# EAGLE design lm3410-boost-flashlight-driver-20mm-mk-1.3.1 (EAGLE 7.5.0)
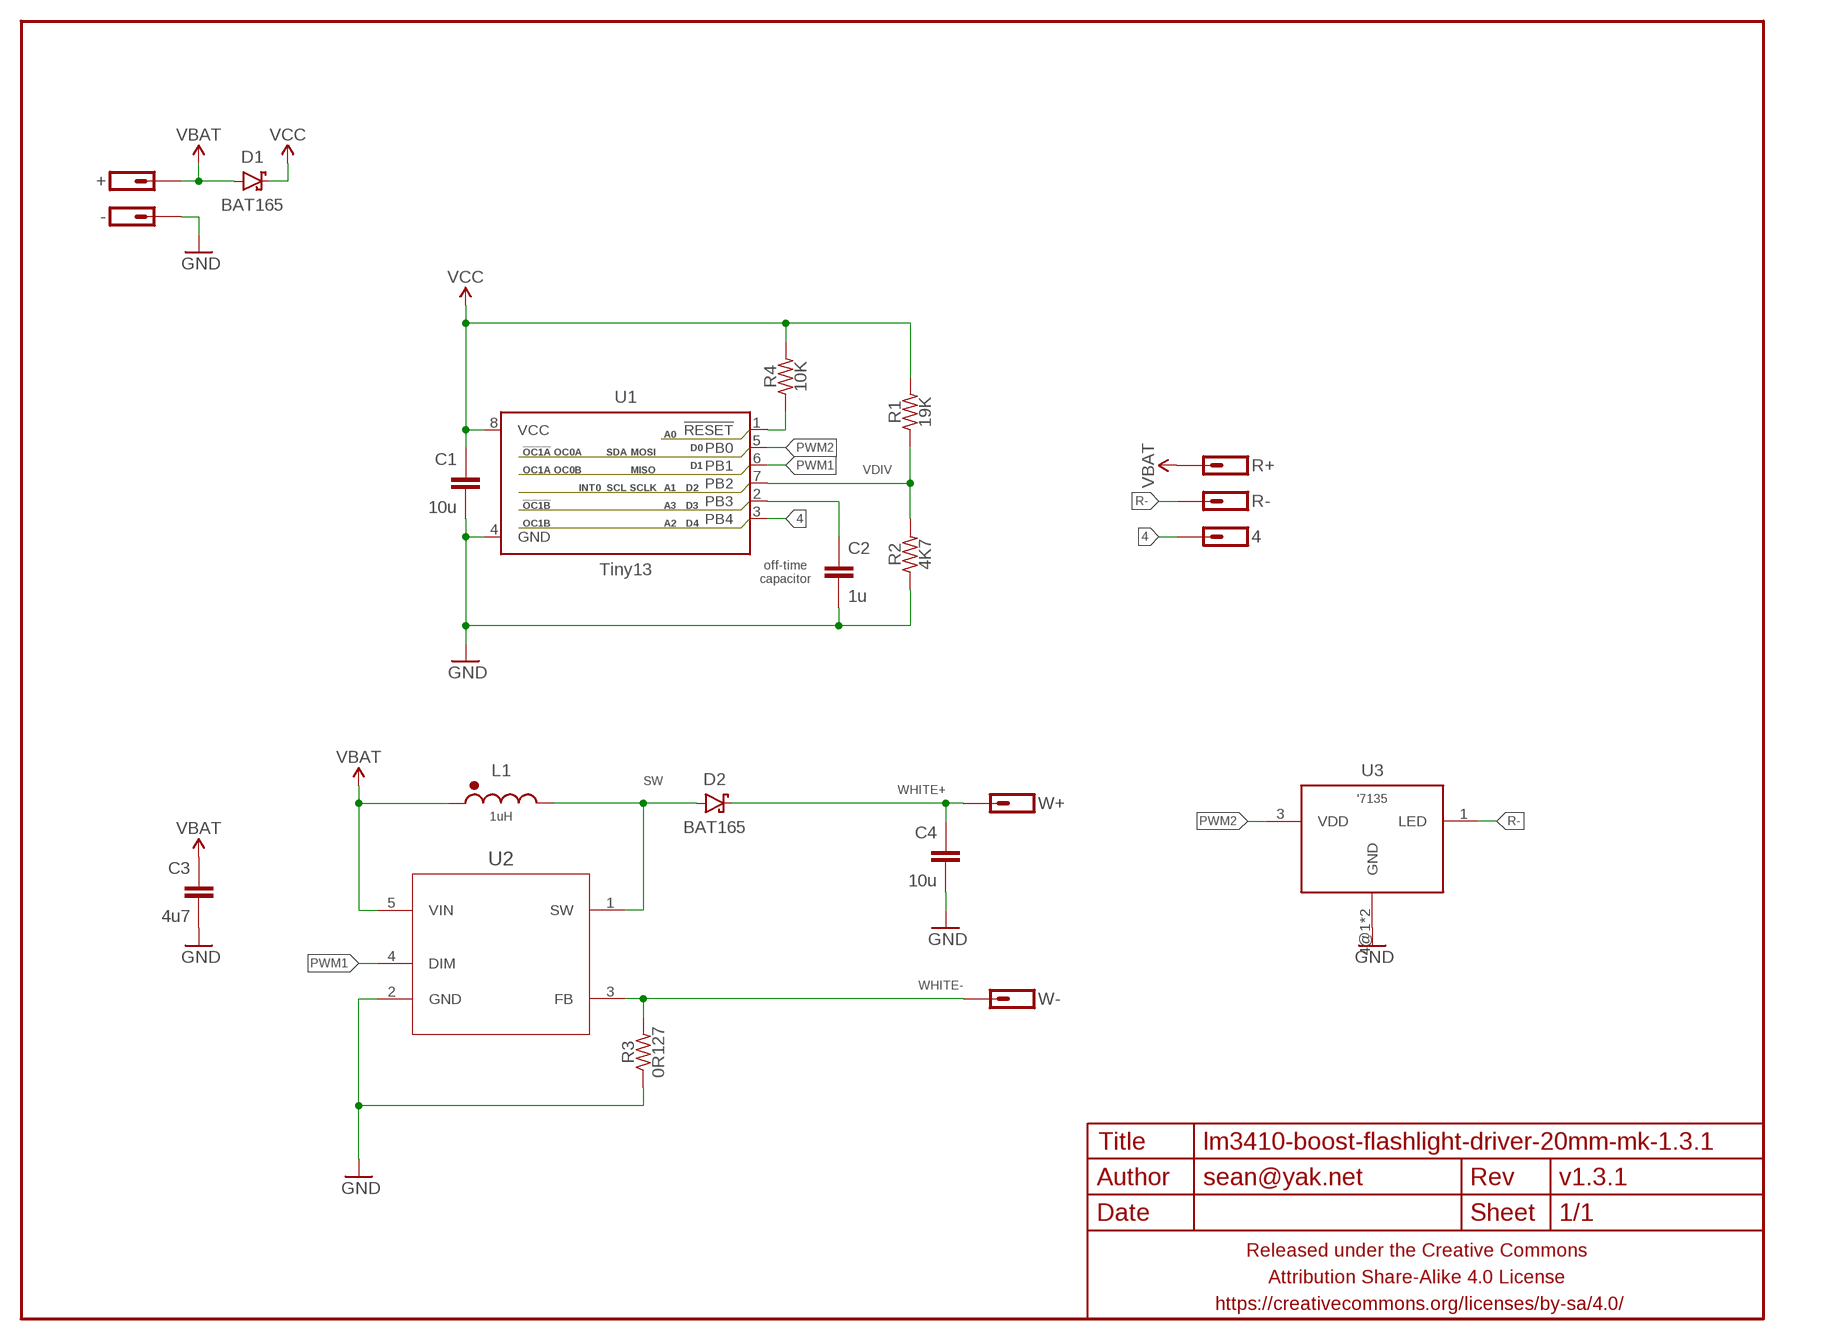
[diagram p0: schematic, sheet 1]

## Parts
4  M01SMD-1MM-DIA-NS  [1X01-SMD-1MM-DIA-NS]
+  M01PTH-1MM-CIR-NS  [1X01-1MM-CIR-NS]
-  M01NOT-A-VIA-NOPE  [1X01_NOSILK_NOSTOP]
C1  10u  CAPACITOR-CERAMICC0603-TIGHTER  [C0603-TIGHTER]
C2  1u  CAPACITOR-CERAMICC0603-TIGHTER  [C0603-TIGHTER]
C3  4u7  CAPACITOR-CERAMICC0603-TIGHTER  [C0603-TIGHTER]
C4  10u  CAPACITOR-CERAMICC0603-TIGHTER  [C0603-TIGHTER]
D1  BAT165  DIODE-SCHOTTKYSOD323  [SOD323-SCHOTTKY]
D2  BAT165  DIODE-SCHOTTKYSOD123  [SOD123-SCHOTTKY]
FRAME1  FRAME-LETTERNO_PACKAGE  [DUMMY]
L1  1uH  INDUCTORPFL2512  [PFL2512]
R1  19K  RESISTORR0603-TIGHTER  [R0603-TIGHTER]
R2  4K7  RESISTORR0603-TIGHTER  [R0603-TIGHTER]
R3  0R127  RESISTORR0805  [R0805]
R4  10K  RESISTORR0402  [R0402]
R+  M01SMD-1MM-DIA-NS  [1X01-SMD-1MM-DIA-NS]
R-  M01SMD-1MM-DIA-NS  [1X01-SMD-1MM-DIA-NS]
U1  Tiny13  ATTINY13SOIC-NARROWPADS  [SO08-NARROWER]
U2  LM3410XMF  [SOT95P285X120-5N]
U3  '7135  AMC7135SOT-89-NOTHERM  [SOT89-NOTHERM]
W+  M01PTH-1.2MM-NS  [1X01-1.2MM-NS]
W-  M01PTH-1.2MM-NS  [1X01-1.2MM-NS]

## Nets
4: 4.P$1 U1.3(PB4)
GND: -.P$1 C1.2 C2.2 C3.2 C4.2 R2.1 R3.1 U1.4(GND) U2.2(GND) U3.4@1(GND) U3.4@2(GND)
N$1: R4.1 U1.1(!RESET)
N$2: C2.1 U1.2(PB3)
PWM1: U1.6(PB1) U2.4(DIM)
PWM2: U1.5(PB0) U3.3(VDD)
R-: R-.P$1 U3.1(LED)
SW: D2.A L1.P$2 U2.1(SW)
VBAT: +.1 C3.1 D1.A L1.P$1 R+.P$1 U2.5(VIN)
VCC: C1.1 D1.C R1.2 R4.2 U1.8(VCC)
VDIV: R1.1 R2.2 U1.7(PB2)
WHITE+: C4.1 D2.C W+.P$1
WHITE-: R3.2 U2.3(FB) W-.P$1

## Notes on the sheet
- off-time
  capacitor

## Library data of the parts
4 + - R+ R- W+ W- = a_parts:M01: Header 1 Standard 1-pin 0.1" header. Use with straight break away headers (SKU : PRT-00116), right angle break away headers (PRT-00553), swiss pins (PRT-00743), machine pins (PRT-00117), and female headers (PRT-00115).
C1-C4 = a_parts:CAPACITOR-CERAMIC: CAPACITOR, European symbol
D1 D2 = a_parts:DIODE-SCHOTTKY: Schottky diodes in SFE's production catalog BAT20J 1A 23V 0.62Vf RB751 120mA 40V 0.37Vf PMEG4005EJ 0.5A 40V 0.42Vf MBRA140 1A 40V 0.5Vf B340A 3A 40V SMA
FRAME1 = a_parts:FRAME-LETTER: Schematic Frame Standard 8.5x11 US Letter frame; DESIGNER: sean@yak.net; VERSION: v1.3.1
L1 = a_parts:INDUCTOR: Inductors Basic Inductor/Choke - 0603 and 1206. Footprints are not proven and vary greatly between part numbers. SRN6045- 33uH, 20% 1.4A SDR0403-560KL - 56uH, 10%, 500mA RMS/740mA peak
R1-R4 = a_parts:RESISTOR: RESISTOR, American symbol
U1 = a_parts:ATTINY13: Atmel 8-pin 1kB flash uC
U2 = a_parts:LM3410XMF: Constant Current Boost and SEPIC LED Driver; MPN: LM3410XMF; OC_FARNELL: 1685357; OC_NEWARK: 75M6032; PACKAGE: SOT-5; SUPPLIER: National Semiconductor
U3 = a_parts:AMC7135

## Board
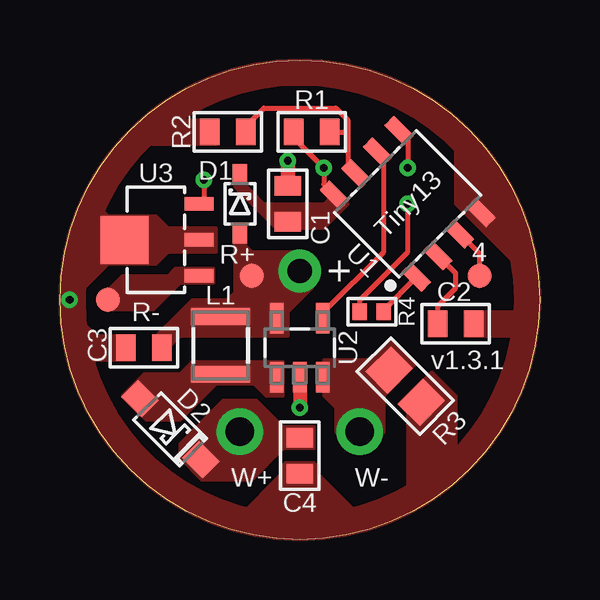
[diagram p1: board, top side]
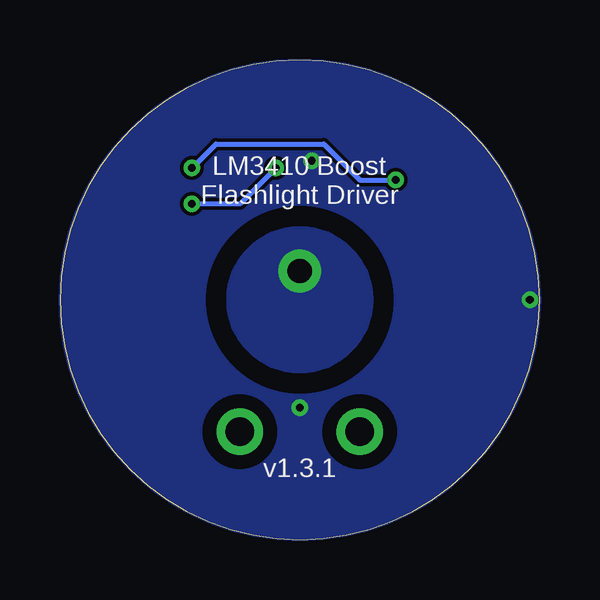
[diagram p2: board, bottom side, seen from below]

Size 20 x 20 mm. Coordinates in mm from the lower left corner, seen from the top.
Outline: 0,10 arc-180 20,10 arc-180 0,10
Copper layers (1*16): Top 0.0356mm / dielectric 1.5011mm / Bottom 0.0356mm
Design rules "LaenPCBOrder2 *": minimum track width 6mil, minimum drill 13mil, track to track 6mil, track to pad 6mil, pad to pad 6mil, via to via 6mil, smd to smd 6mil, copper to edge 0mil, drill to drill 6mil, minimum pad ring 7mil, minimum via ring 7mil, stop-mask expansion 3mil, vias tented up to drill 20mil, thermal gap 10mil
bRestrict: area 6.2,3.2 to 8.8,5.8; area 11.2,3.2 to 13.8,5.8; area 6.5,6.5 to 13.5,13.5

### Footprints (pad centres in the part's own frame; a part is rotated, then mirrored left to right if it is on the bottom)
1X01-SMD-1MM-DIA-NS = smd 1 x 1: P$1 0,0
1X01-1MM-CIR-NS = drill 1.016 pad 1.778: 1 0,0
1X01_NOSILK_NOSTOP = drill 0.33: P$1 0,0
C0603-TIGHTER = smd 0.8 x 1.1: 1 -0.75,0; 2 0.75,0
SOD323-SCHOTTKY = smd 0.8 x 0.6: A -1.25,0; C 1.25,0
SOD123-SCHOTTKY = smd 1.2 x 1: A -1.8,0; C 1.8,0
PFL2512 = smd 0.7 x 2.45: P$1 -1.2,0; P$2 1.2,0
R0603-TIGHTER = smd 0.8 x 1.1: 1 -0.75,0; 2 0.75,0
R0805 = smd 1.3 x 1.5: 1 -0.95,0; 2 0.95,0
R0402 = smd 0.6 x 0.7: 1 -0.5,0; 2 0.5,0
SO08-NARROWER = smd 0.6 x 1.2: 1 -1.905,-2.416; 2 -0.635,-2.416; 3 0.635,-2.416; 4 1.905,-2.416; 5 1.905,2.416; 6 0.635,2.416; 7 -0.635,2.416; 8 -1.905,2.416
SOT95P285X120-5N = smd 1.27 x 0.559: 1 -1.219,0.965; 2 -1.219,0; 3 -1.219,-0.965; 4 1.219,-0.965; 5 1.219,0.965
SOT89-NOTHERM = smd 0.58 x 1.2: 1 -1.5,-1.8; 3 1.5,-1.8; 4@1 0,-1.8 | smd 2 x 2: 4@2 0,1.3
1X01-1.2MM-NS = drill 1.2 pad 1.93: P$1 0,0

### Placement (x,y rotation side)
4  17.5,11 0 top
+  10,11.2 180 top
-  0.4,10 90 bottom
C1  9.5,14 90 top
C2  16.5,9 0 top
C3  3.5,8 180 top
C4  10,3.5 270 top
D1  7.5,14 90 top
D2  4.6,4.6 315 top
FRAME1  0,0 0 top
L1  6.7,8.1 270 top
R1  10.5,17 180 top
R2  7,17 0 top
R3  14.4,6.4 135 top
R4  13,9.5 180 top
R+  8,11 0 top
R-  2,10 180 top
U1  14.5,14 45 top
U2  10,8 90 top
U3  4,12.5 90 top
W+  7.5,4.5 270 top
W-  12.5,4.5 180 top

### Tracks (layer width: path | path; a pad name or v marks a point on that pad's centre or on a via)
4
  Top 0.2: 4.P$1 17.5,11.9 U1.3
GND  (via drill 0.33)
  Top 0.575: U2.2 v10,5.5
  Top 0.6: v9.5,15.8 C1.2
  pour Top (isolate 0.152, rank 6, no thermals): 0,10 arc90 10,0 arc90 20,10 19,10 arc-90 10,1 arc-90 1,10
  pour Bottom (isolate 0.152, rank 6, no thermals): 10,0 arc-90 0,10 arc-90 10,20 arc-90 20,10 arc-90
  pour Top (isolate 0.152, rank 6, no thermals): 20,10 arc90 10,20 arc90 0,10 1,10 arc-90 10,19 arc-90 19,10
  pour Top (isolate 0.152, rank 5, no thermals): 7.5,1 9.2,2.7 9.2,3 9.4,3.2 10.6,3.2 10.8,3 10.8,2.7 12.5,1
  pour Top (isolate 0.152, rank 5, no thermals): 14.5,5.5 14.5,2 15,2 16.5,3.5 16.5,6 15.5,7 14.5,6
  pour Top (isolate 0.152, rank 5, no thermals): 17,9.5 17,8.5 19,8.5 19,9.5
  pour Top (isolate 0.152, rank 5, no thermals): 16.5,14 19,11.5 19,13.5 17.5,15 17.5,15.5 16.5,16.5
  pour Top (isolate 0.152, rank 5, no thermals): 3.5,16.5 6.5,16.5 6.5,17.5 4,17.5 3.5,17
  pour Top (isolate 0.152, rank 5, no thermals): 2,11.5 4,11.5 4.5,12 6.5,12 6.5,13 4.5,13 4,13.5 2,13.5 1.5,14 1,13.5 1,12 0.5,11.5 0.5,10.5 1,10.5
  pour Top (isolate 0.152, rank 5, no thermals): 1,9 1.5,8.5 3.1,8.5 3.1,7.5 1.5,7.5 1,7
N$1
  Top 0.2: R4.1 13.5,9.58 U1.1
N$2
  Top 0.2: C2.1 15.75,9.75 16.5,10.5 16.5,11.1 U1.2
PWM1
  Top 0.2: U2.4 10.96,9.46 13.5,12 13.5,15.9 U1.6
PWM2  (via drill 0.33)
  Top 0.2: v6,15 6,14.2 U3.3 | U1.5 14.5,16.69 v14.5,15.5
  Bottom 0.2: v14.5,15.5 13.5,16.5 9,16.5 7.5,15 v6,15
R-
  pour Top (isolate 0.152, rank 5, no thermals): 2,10.4 2.6,11 4.5,11 4.8,11.3 6.4,11.3 6.4,10.7 5,10.7 3.9,9.6 2,9.6
SW
  pour Top (isolate 0.152, rank 5, no thermals): 2.6,6 3.6,5 5,5 6.5,6.5 8.1,6.5 8.6,6 9.3,6 9.3,7.4 5.5,7.4 5,6.9 3.5,6.9
VBAT
  pour Bottom (isolate 0.152, no thermals): 7,10 arc-180 13,10 arc-180
  pour Top (isolate 0.152, rank 5, no thermals): 4,8.5 5.5,10 7,10 7.3,10.3 7.3,13 7.7,13 7.7,12.3 8,12 10,12 10.5,11.5 10.5,10.5 9.5,9.5 9.5,8.5 5,8.5 4.5,8 4,8
VCC  (via drill 0.33)
  Top 0.2: R1.2 9.75,16.75 v11,15.5 11,14.81 U1.8 11.81,14 | R4.2 12.5,10 14.5,12 v14.5,14
  Bottom 0.2: v11,15.5 12.5,14 v14.5,14
  pour Top (isolate 0.152, rank 5, no thermals): 7.3,15.5 7.3,14.7 9,13 11,13 12,14 11.5,14.5 11,14 8.5,14 7.7,14.8 7.7,15.5
VDIV
  Top 0.2: R2.2 7.75,17.25 8.5,18 11.5,18 12,17.5 12,17 | 12,17 12,15.6 U1.7 | R1.1 12,17
WHITE+
  pour Top (isolate 0.152, rank 5, no thermals): 5,4 6.8,5.8 8.2,5.8 9.3,4.7 10.6,4.7 10.6,3.8 9.3,3.8 8,2.5 5.9,2.5 5,3.4
WHITE-
  pour Top (isolate 0.152, rank 5, no thermals): 11.5,4.5 11.5,5.5 11,6 11,7.5 13,7.5 13.8,8.3 14.8,7.3 13.5,6 13.5,4.5 13,4 12,4

### Text on the board
bPlace: LM3410 Boost / Flashlight Driver